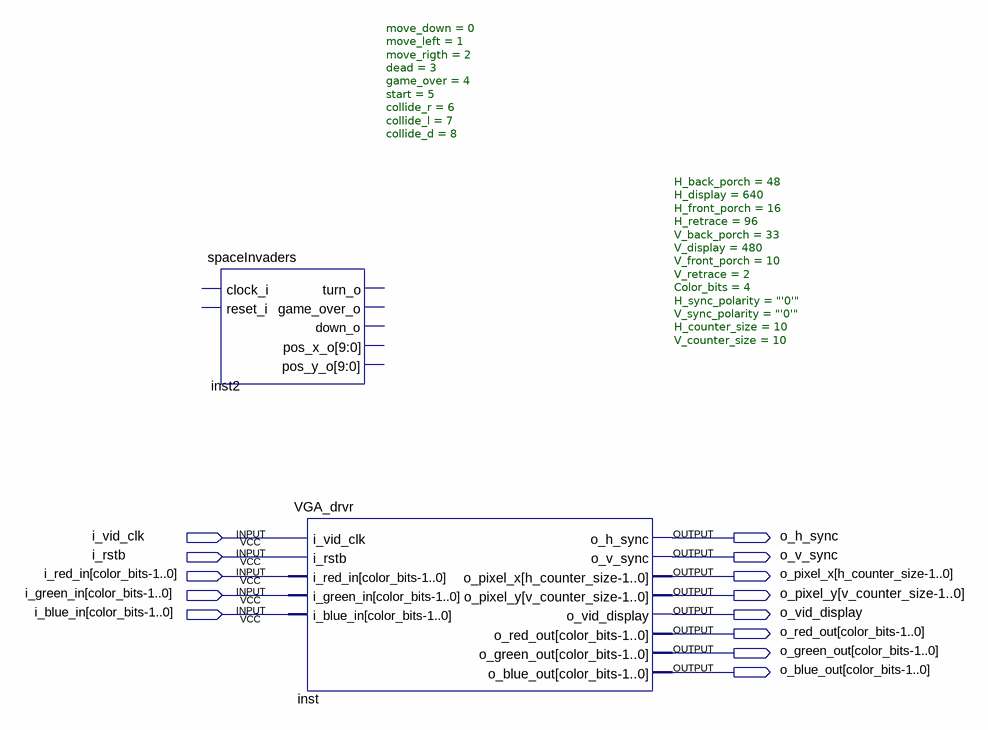
[diagram p0: schematic sheet]
// Quartus schematic general.bdf as structural Verilog: 2 symbols, 13 pins
module general (
  input  i_vid_clk,
  input  i_rstb,
  input  \i_red_in[color_bits-1..0] ,
  input  \i_green_in[color_bits-1..0] ,
  input  \i_blue_in[color_bits-1..0] ,
  output o_h_sync,
  output o_v_sync,
  output \o_pixel_x[h_counter_size-1..0] ,
  output \o_pixel_y[v_counter_size-1..0] ,
  output o_vid_display,
  output \o_red_out[color_bits-1..0] ,
  output \o_green_out[color_bits-1..0] ,
  output \o_blue_out[color_bits-1..0] 
);

  spaceInvaders #(.move_down(0), .move_left(1), .move_rigth(2), .dead(3), .game_over(4), .start(5), .collide_r(6), .collide_l(7), .collide_d(8)) inst2 ();  // open: clock_i, reset_i, turn_o, game_over_o, down_o, pos_x_o, pos_y_o
  VGA_drvr #(.H_back_porch(48), .H_display(640), .H_front_porch(16), .H_retrace(96), .V_back_porch(33), .V_display(480), .V_front_porch(10), .V_retrace(2), .Color_bits(4), .H_sync_polarity("'0'"), .V_sync_polarity("'0'"), .H_counter_size(10), .V_counter_size(10)) inst (
    .i_vid_clk(i_vid_clk), .i_rstb(i_rstb), .i_red_in({4{\i_red_in[color_bits-1..0] }}),
    .i_green_in({4{\i_green_in[color_bits-1..0] }}), .i_blue_in({4{\i_blue_in[color_bits-1..0] }}),
    .o_h_sync(o_h_sync), .o_v_sync(o_v_sync), .o_pixel_x(\o_pixel_x[h_counter_size-1..0] ),
    .o_pixel_y(\o_pixel_y[v_counter_size-1..0] ), .o_vid_display(o_vid_display),
    .o_red_out(\o_red_out[color_bits-1..0] ), .o_green_out(\o_green_out[color_bits-1..0] ),
    .o_blue_out(\o_blue_out[color_bits-1..0] ));
endmodule
